# Altium schematic sheet EPS_SCH.SchDoc
size A
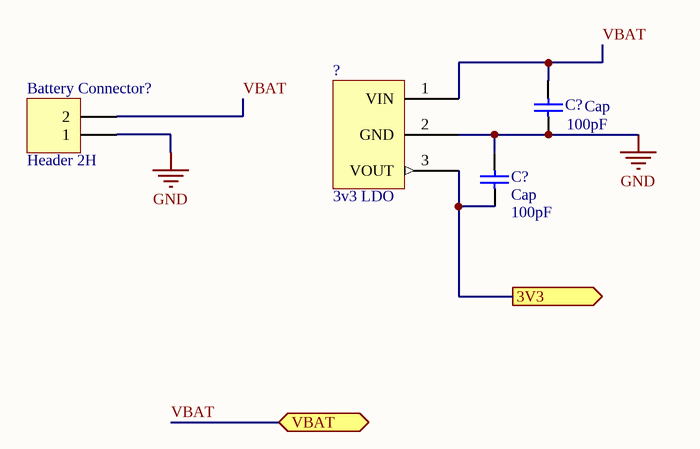
[diagram p0: EPS_SCH.SchDoc]

## Parts
(Parts that share a designator on the sheet are numbered #1, #2 ... from top to bottom, then left to right.)
?  3v3 LDO
Battery_Connector?  Header 2H  [HDR1X2H]
C?#1  Cap  value 100pF  [RAD-0.3]
C?#2  Cap  value 100pF  [RAD-0.3]

## Ports
3V3 (out), VBAT

## Nets
GND: ?.2(GND) Battery_Connector?.1 C?#1.1 C?#2.2
3V3: ?.3(VOUT) C?#2.1 ; port 3V3
VBAT: ?.1(VIN) Battery_Connector?.2 C?#1.2 ; port VBAT

## Library data of the parts
? = 3v3 LDO: MCP1826S-3302E/AB
Battery_Connector? = Header 2H: Header, 2-Pin, Right Angle; LatestRevisionDate: 17-Jul-2002; LatestRevisionNote: Re-released for DXP Platform.; Publisher: Altium Limited
C?#1 C?#2 = Cap: Capacitor; Published: 8-Jun-2000; LatestRevisionDate: 17-Jul-2002; LatestRevisionNote: Re-released for DXP Platform.; PackageReference: RAD-0.3; Publisher: Altium Limited; PackageDescription: Radial Cap, Thru-Hole; 2 Leads; 0.3 in Pin Spacing